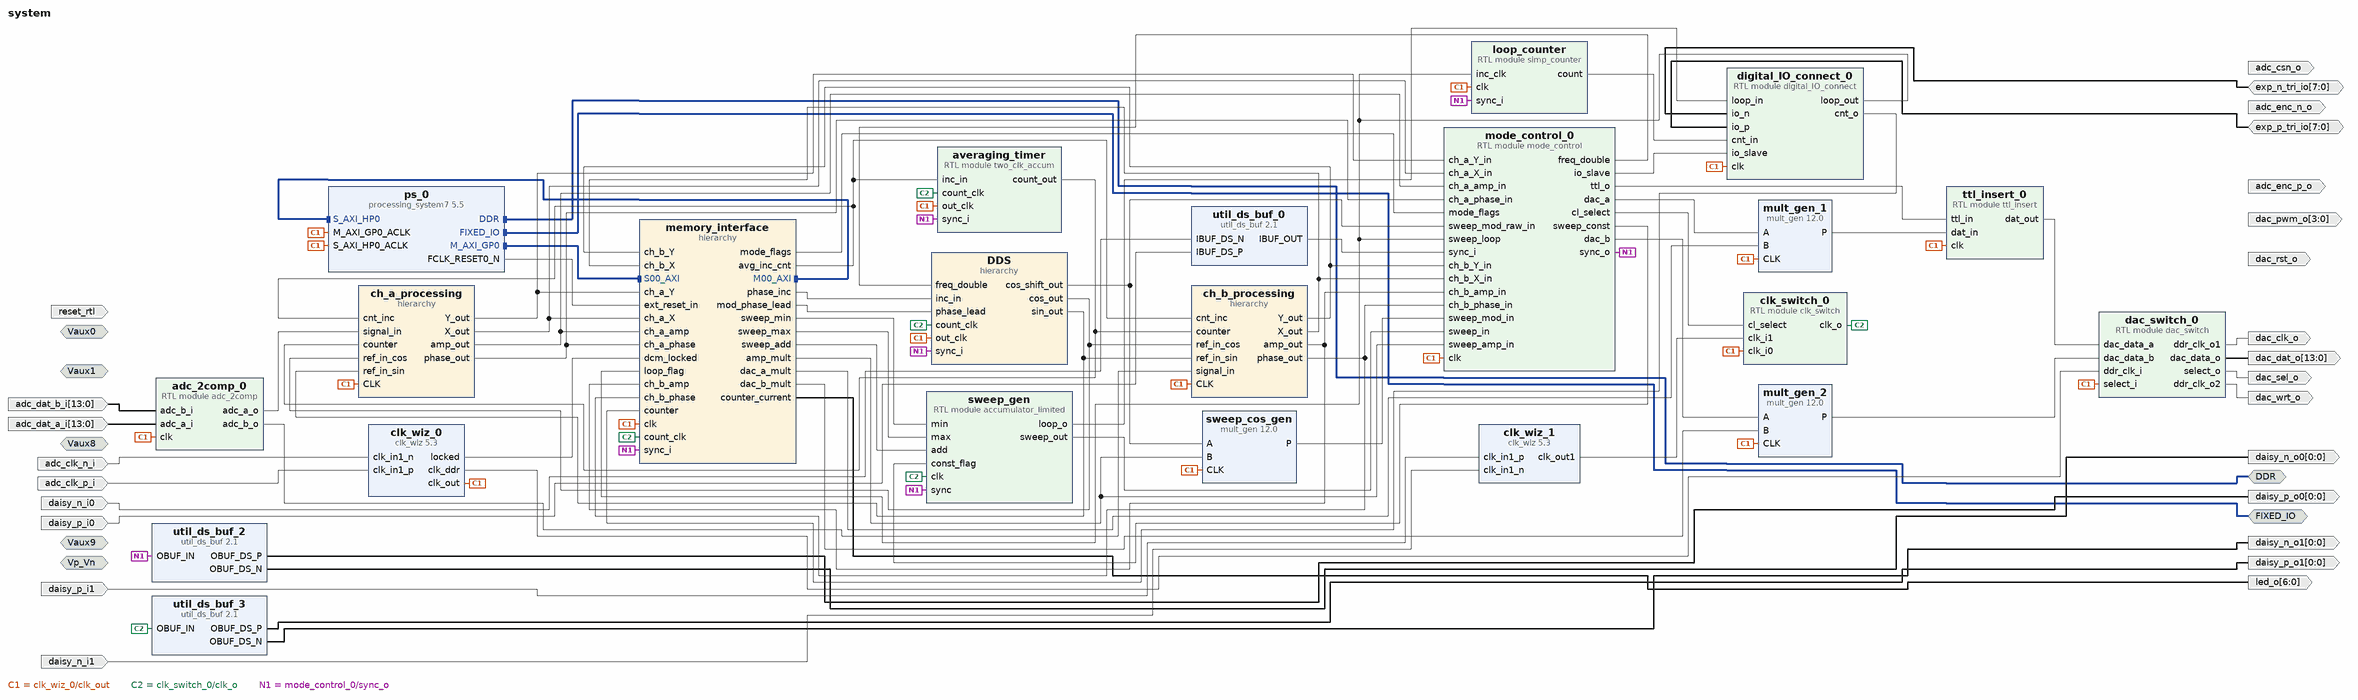
[diagram p0: block diagram of the top level]
# Vivado block design system, xc7z010clg400-1, Vivado 2016.3
create_bd_design system

create_bd_intf_port -mode Master -vlnv xilinx.com:interface:ddrx_rtl:1.0 DDR
create_bd_intf_port -mode Master -vlnv xilinx.com:display_processing_system7:fixedio_rtl:1.0 FIXED_IO
create_bd_intf_port -mode Slave -vlnv xilinx.com:interface:diff_analog_io_rtl:1.0 Vp_Vn
create_bd_intf_port -mode Slave -vlnv xilinx.com:interface:diff_analog_io_rtl:1.0 Vaux0
create_bd_intf_port -mode Slave -vlnv xilinx.com:interface:diff_analog_io_rtl:1.0 Vaux1
create_bd_intf_port -mode Slave -vlnv xilinx.com:interface:diff_analog_io_rtl:1.0 Vaux9
create_bd_intf_port -mode Slave -vlnv xilinx.com:interface:diff_analog_io_rtl:1.0 Vaux8
create_bd_port -dir O adc_enc_p_o
create_bd_port -dir O adc_enc_n_o
create_bd_port -dir O adc_csn_o
create_bd_port -dir O -from 3 -to 0 dac_pwm_o
create_bd_port -dir I -type rst reset_rtl
set_property -dict {CONFIG.POLARITY ACTIVE_HIGH} [get_bd_ports reset_rtl]
create_bd_port -dir O dac_rst_o
create_bd_port -dir O -from 13 -to 0 dac_dat_o
create_bd_port -dir O dac_sel_o
create_bd_port -dir O dac_clk_o
create_bd_port -dir O dac_wrt_o
create_bd_port -dir I -from 13 -to 0 adc_dat_b_i
create_bd_port -dir I -from 13 -to 0 adc_dat_a_i
create_bd_port -dir IO -from 7 -to 0 exp_n_tri_io
create_bd_port -dir IO -from 7 -to 0 exp_p_tri_io
create_bd_port -dir I daisy_n_i0
create_bd_port -dir I daisy_p_i0
create_bd_port -dir O -from 0 -to 0 daisy_p_o0
create_bd_port -dir O -from 0 -to 0 daisy_n_o0
create_bd_port -dir O -from 0 -to 0 daisy_p_o1
create_bd_port -dir O -from 0 -to 0 daisy_n_o1
create_bd_port -dir I adc_clk_n_i
create_bd_port -dir I adc_clk_p_i
create_bd_port -dir I daisy_p_i1
create_bd_port -dir I daisy_n_i1
create_bd_port -dir O -from 6 -to 0 led_o

create_bd_cell -type ip -vlnv xilinx.com:ip:processing_system7:5.5 ps_0
set_property -dict [list \
  CONFIG.PCW_FPGA0_PERIPHERAL_FREQMHZ 125 \
  CONFIG.PCW_FPGA1_PERIPHERAL_FREQMHZ 250 \
  CONFIG.PCW_USE_S_AXI_HP0 1 \
  CONFIG.PCW_S_AXI_HP0_DATA_WIDTH 32 \
  CONFIG.PCW_EN_CLK0_PORT 0 \
  CONFIG.PCW_IMPORT_BOARD_PRESET cfg/red_pitaya.xml \
] [get_bd_cells ps_0]
# 4 more settings of ps_0 are not shown: defaults, MIO pin electricals, DDR timing, and values the tool derives
create_bd_cell -type hier DDS
create_bd_cell -type hier ch_a_processing
create_bd_cell -type ip -vlnv xilinx.com:ip:util_ds_buf:2.1 util_ds_buf_0
create_bd_cell -type ip -vlnv xilinx.com:ip:util_ds_buf:2.1 util_ds_buf_2
set_property -dict {CONFIG.C_BUF_TYPE OBUFDS} [get_bd_cells util_ds_buf_2]
create_bd_cell -type ip -vlnv xilinx.com:ip:util_ds_buf:2.1 util_ds_buf_3
set_property -dict {CONFIG.C_BUF_TYPE OBUFDS} [get_bd_cells util_ds_buf_3]
create_bd_cell -type ip -vlnv xilinx.com:ip:clk_wiz:5.3 clk_wiz_0
set_property -dict [list \
  CONFIG.ENABLE_CLOCK_MONITOR false \
  CONFIG.PRIMITIVE MMCM \
  CONFIG.PRIM_IN_FREQ 125.000 \
  CONFIG.USE_INCLK_SWITCHOVER false \
  CONFIG.SECONDARY_IN_FREQ 125 \
  CONFIG.SECONDARY_SOURCE Differential_clock_capable_pin \
  CONFIG.CLKIN1_JITTER_PS 80.0 \
  CONFIG.CLKIN2_JITTER_PS 80.0 \
  CONFIG.CLKOUT2_USED true \
  CONFIG.CLKOUT3_USED false \
  CONFIG.NUM_OUT_CLKS 2 \
  CONFIG.CLK_OUT1_PORT clk_out \
  CONFIG.CLK_OUT2_PORT clk_ddr \
  CONFIG.CLKOUT1_REQUESTED_OUT_FREQ 125 \
  CONFIG.CLKOUT2_REQUESTED_OUT_FREQ 250 \
  CONFIG.CLKOUT3_REQUESTED_OUT_FREQ 100.000 \
  CONFIG.CLKOUT3_REQUESTED_PHASE 0.000 \
  CONFIG.PRIM_SOURCE Differential_clock_capable_pin \
  CONFIG.CLKOUT1_DRIVES BUFG \
  CONFIG.CLKOUT2_DRIVES BUFG \
  CONFIG.CLKOUT3_DRIVES BUFG \
  CONFIG.CLKOUT4_DRIVES BUFG \
  CONFIG.CLKOUT5_DRIVES BUFG \
  CONFIG.CLKOUT6_DRIVES BUFG \
  CONFIG.CLKOUT7_DRIVES BUFG \
  CONFIG.FEEDBACK_SOURCE FDBK_AUTO \
  CONFIG.CLKFB_IN_SIGNALING SINGLE \
  CONFIG.USE_CLKFB_STOPPED false \
  CONFIG.OVERRIDE_MMCM false \
  CONFIG.MMCM_DIVCLK_DIVIDE 1 \
  CONFIG.MMCM_CLKFBOUT_MULT_F 8.000 \
  CONFIG.MMCM_CLKIN1_PERIOD 8.0 \
  CONFIG.MMCM_CLKIN2_PERIOD 8.000 \
  CONFIG.MMCM_COMPENSATION ZHOLD \
  CONFIG.MMCM_CLKOUT0_DIVIDE_F 8.000 \
  CONFIG.MMCM_CLKOUT1_DIVIDE 4 \
  CONFIG.MMCM_CLKOUT2_DIVIDE 1 \
  CONFIG.MMCM_CLKOUT2_PHASE 0.000 \
  CONFIG.CLKOUT1_JITTER 119.348 \
  CONFIG.CLKOUT1_PHASE_ERROR 96.948 \
  CONFIG.CLKOUT2_JITTER 104.759 \
  CONFIG.CLKOUT2_PHASE_ERROR 96.948 \
  CONFIG.CLKOUT3_JITTER 119.348 \
  CONFIG.CLKOUT3_PHASE_ERROR 96.948 \
] [get_bd_cells clk_wiz_0]
create_bd_cell -type ip -vlnv xilinx.com:ip:clk_wiz:5.3 clk_wiz_1
set_property -dict [list \
  CONFIG.PRIMITIVE PLL \
  CONFIG.PRIM_IN_FREQ 125 \
  CONFIG.CLKIN1_JITTER_PS 80.0 \
  CONFIG.CLKOUT1_REQUESTED_OUT_FREQ 125 \
  CONFIG.PRIM_SOURCE Differential_clock_capable_pin \
  CONFIG.CLKOUT1_DRIVES BUFG \
  CONFIG.CLKOUT2_DRIVES BUFG \
  CONFIG.CLKOUT3_DRIVES BUFG \
  CONFIG.CLKOUT4_DRIVES BUFG \
  CONFIG.CLKOUT5_DRIVES BUFG \
  CONFIG.CLKOUT6_DRIVES BUFG \
  CONFIG.CLKOUT7_DRIVES BUFG \
  CONFIG.MMCM_DIVCLK_DIVIDE 1 \
  CONFIG.MMCM_CLKFBOUT_MULT_F 7 \
  CONFIG.MMCM_CLKIN1_PERIOD 8.0 \
  CONFIG.MMCM_COMPENSATION ZHOLD \
  CONFIG.MMCM_CLKOUT0_DIVIDE_F 7 \
  CONFIG.CLKOUT1_JITTER 125.031 \
  CONFIG.CLKOUT1_PHASE_ERROR 104.065 \
] [get_bd_cells clk_wiz_1]
create_bd_cell -type hier ch_b_processing
create_bd_cell -type ip -vlnv xilinx.com:ip:mult_gen:12.0 sweep_cos_gen
set_property -dict [list \
  CONFIG.PortAType Signed \
  CONFIG.PortAWidth 16 \
  CONFIG.PortBType Unsigned \
  CONFIG.PortBWidth 32 \
  CONFIG.Multiplier_Construction Use_Mults \
  CONFIG.Use_Custom_Output_Width true \
  CONFIG.OutputWidthHigh 47 \
  CONFIG.OutputWidthLow 24 \
  CONFIG.PipeStages 4 \
] [get_bd_cells sweep_cos_gen]
create_bd_cell -type ip -vlnv xilinx.com:ip:mult_gen:12.0 mult_gen_1
set_property -dict [list \
  CONFIG.PortAType Signed \
  CONFIG.PortAWidth 24 \
  CONFIG.PortBType Unsigned \
  CONFIG.PortBWidth 16 \
  CONFIG.Multiplier_Construction Use_Mults \
  CONFIG.Use_Custom_Output_Width true \
  CONFIG.OutputWidthHigh 23 \
  CONFIG.OutputWidthLow 10 \
  CONFIG.PipeStages 3 \
] [get_bd_cells mult_gen_1]
create_bd_cell -type ip -vlnv xilinx.com:ip:mult_gen:12.0 mult_gen_2
set_property -dict [list \
  CONFIG.PortAType Signed \
  CONFIG.PortAWidth 24 \
  CONFIG.PortBType Unsigned \
  CONFIG.PortBWidth 16 \
  CONFIG.Multiplier_Construction Use_Mults \
  CONFIG.Use_Custom_Output_Width true \
  CONFIG.OutputWidthHigh 23 \
  CONFIG.OutputWidthLow 10 \
  CONFIG.PipeStages 3 \
] [get_bd_cells mult_gen_2]
create_bd_cell -type hier memory_interface
create_bd_cell -type module -reference accumulator_limited sweep_gen
set_property -dict {CONFIG.accum_bits 40 CONFIG.out_bits 24} [get_bd_cells sweep_gen]
create_bd_cell -type module -reference mode_control mode_control_0
set_property -dict [list \
  CONFIG.in_bits_sweep 24 \
  CONFIG.in_bits_sweep_mod 24 \
  CONFIG.phase_correct_bits 2 \
  CONFIG.out_bits_dac 24 \
] [get_bd_cells mode_control_0]
create_bd_cell -type module -reference ttl_insert ttl_insert_0
create_bd_cell -type module -reference simp_counter loop_counter
set_property -dict {CONFIG.CNT_BITS 7} [get_bd_cells loop_counter]
create_bd_cell -type module -reference adc_2comp adc_2comp_0
create_bd_cell -type module -reference clk_switch clk_switch_0
create_bd_cell -type module -reference dac_switch dac_switch_0
create_bd_cell -type module -reference digital_IO_connect digital_IO_connect_0
set_property -dict {CONFIG.cnt_bits 7} [get_bd_cells digital_IO_connect_0]
create_bd_cell -type module -reference two_clk_accum averaging_timer

# ---- hierarchy /DDS ----
current_bd_instance /DDS
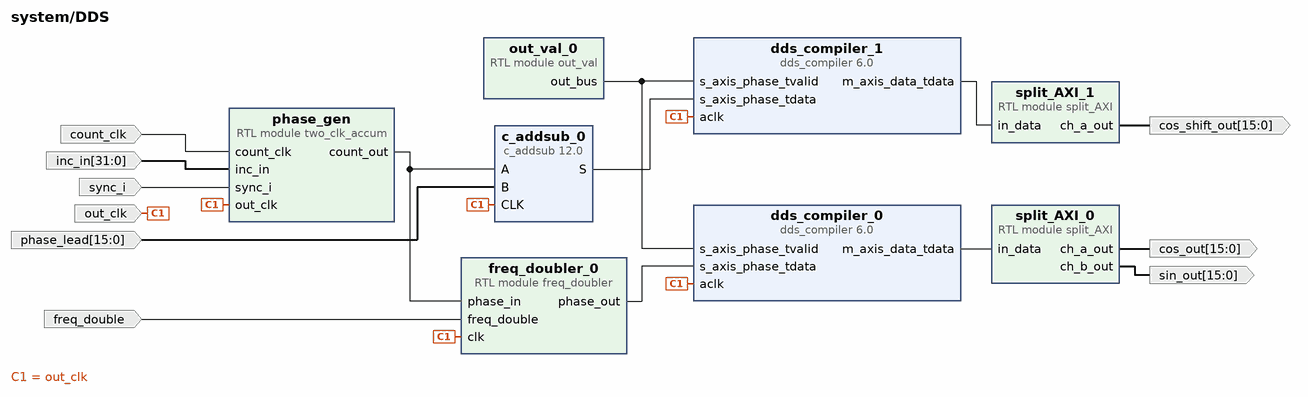
[diagram p1: block diagram inside /DDS]
create_bd_pin -dir I count_clk
create_bd_pin -dir I out_clk
create_bd_pin -dir I -from 31 -to 0 inc_in
create_bd_pin -dir I sync_i
create_bd_pin -dir O -from 15 -to 0 cos_out
create_bd_pin -dir O -from 15 -to 0 sin_out
create_bd_pin -dir O -from 15 -to 0 cos_shift_out
create_bd_pin -dir I freq_double
create_bd_pin -dir I -from 15 -to 0 phase_lead

create_bd_cell -type ip -vlnv xilinx.com:ip:dds_compiler:6.0 dds_compiler_0
set_property -dict [list \
  CONFIG.PartsPresent SIN_COS_LUT_only \
  CONFIG.DDS_Clock_Rate 100 \
  CONFIG.Parameter_Entry Hardware_Parameters \
  CONFIG.Frequency_Resolution 0.4 \
  CONFIG.Noise_Shaping None \
  CONFIG.Phase_Width 16 \
  CONFIG.Output_Width 16 \
  CONFIG.Phase_Increment Streaming \
  CONFIG.Has_Phase_Out false \
  CONFIG.DATA_Has_TLAST Not_Required \
  CONFIG.S_PHASE_Has_TUSER Not_Required \
  CONFIG.M_DATA_Has_TUSER Not_Required \
  CONFIG.Latency 6 \
  CONFIG.Output_Frequency1 0 \
  CONFIG.PINC1 0 \
] [get_bd_cells dds_compiler_0]
create_bd_cell -type ip -vlnv xilinx.com:ip:dds_compiler:6.0 dds_compiler_1
set_property -dict [list \
  CONFIG.PartsPresent SIN_COS_LUT_only \
  CONFIG.DDS_Clock_Rate 100 \
  CONFIG.Parameter_Entry Hardware_Parameters \
  CONFIG.Frequency_Resolution 0.4 \
  CONFIG.Noise_Shaping None \
  CONFIG.Phase_Width 16 \
  CONFIG.Output_Width 16 \
  CONFIG.Phase_Increment Fixed \
  CONFIG.Has_Phase_Out false \
  CONFIG.DATA_Has_TLAST Not_Required \
  CONFIG.S_PHASE_Has_TUSER Not_Required \
  CONFIG.M_DATA_Has_TUSER Not_Required \
  CONFIG.Latency 6 \
  CONFIG.Output_Frequency1 0 \
  CONFIG.PINC1 0 \
] [get_bd_cells dds_compiler_1]
create_bd_cell -type ip -vlnv xilinx.com:ip:c_addsub:12.0 c_addsub_0
set_property -dict [list \
  CONFIG.A_Type Signed \
  CONFIG.B_Type Signed \
  CONFIG.A_Width 16 \
  CONFIG.B_Width 16 \
  CONFIG.Out_Width 16 \
  CONFIG.Latency_Configuration Manual \
  CONFIG.Latency 1 \
  CONFIG.B_Value 0000000000000000 \
  CONFIG.CE false \
] [get_bd_cells c_addsub_0]
create_bd_cell -type module -reference freq_doubler freq_doubler_0
create_bd_cell -type module -reference out_val out_val_0
create_bd_cell -type module -reference split_AXI split_AXI_0
set_property -dict {CONFIG.OUT_DATA_WIDTH 16} [get_bd_cells split_AXI_0]
create_bd_cell -type module -reference split_AXI split_AXI_1
set_property -dict {CONFIG.OUT_DATA_WIDTH 16} [get_bd_cells split_AXI_1]
create_bd_cell -type module -reference two_clk_accum phase_gen
set_property -dict {CONFIG.out_bits 16 CONFIG.out_bus_size 16} [get_bd_cells phase_gen]

# ---- hierarchy /ch_a_processing ----
current_bd_instance /ch_a_processing
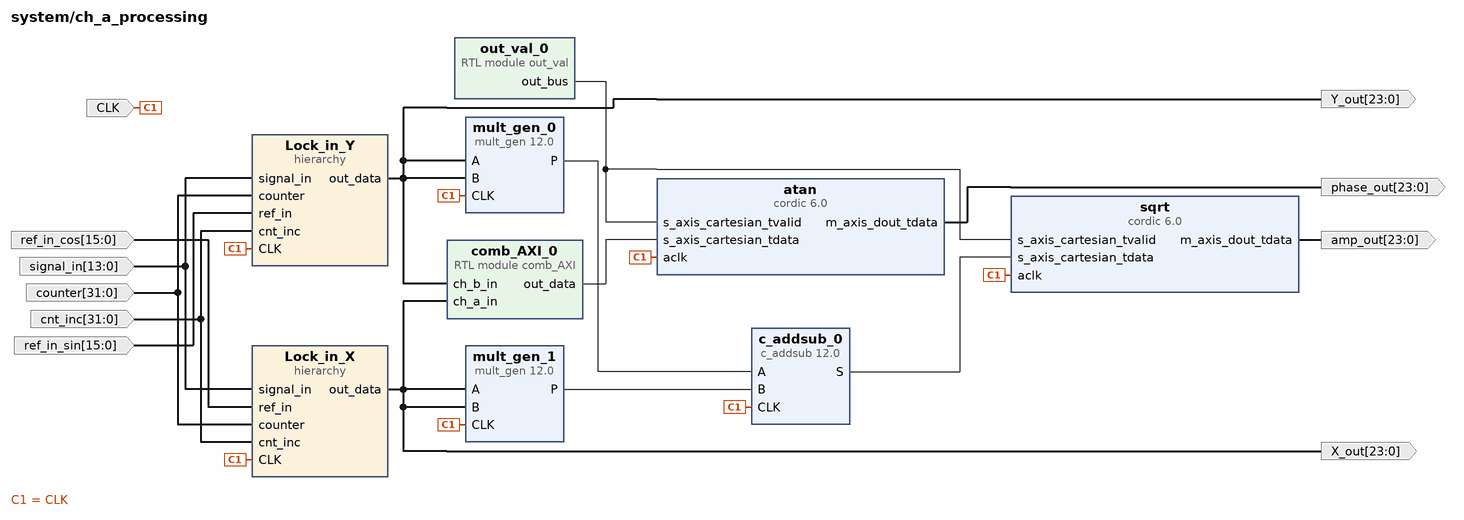
[diagram p2: block diagram inside /ch_a_processing]
create_bd_pin -dir I -type clk CLK
create_bd_pin -dir O -from 23 -to 0 Y_out
create_bd_pin -dir O -from 23 -to 0 X_out
create_bd_pin -dir O -from 23 -to 0 amp_out
create_bd_pin -dir O -from 23 -to 0 phase_out
create_bd_pin -dir I -from 13 -to 0 -type data signal_in
create_bd_pin -dir I -from 31 -to 0 counter
create_bd_pin -dir I -from 31 -to 0 cnt_inc
create_bd_pin -dir I -from 15 -to 0 ref_in_sin
create_bd_pin -dir I -from 15 -to 0 ref_in_cos

create_bd_cell -type ip -vlnv xilinx.com:ip:mult_gen:12.0 mult_gen_0
set_property -dict [list \
  CONFIG.PortAType Signed \
  CONFIG.PortAWidth 24 \
  CONFIG.PortBType Signed \
  CONFIG.PortBWidth 24 \
  CONFIG.Multiplier_Construction Use_Mults \
  CONFIG.Use_Custom_Output_Width true \
  CONFIG.OutputWidthHigh 47 \
  CONFIG.PipeStages 4 \
] [get_bd_cells mult_gen_0]
create_bd_cell -type ip -vlnv xilinx.com:ip:mult_gen:12.0 mult_gen_1
set_property -dict [list \
  CONFIG.PortAType Signed \
  CONFIG.PortAWidth 24 \
  CONFIG.PortBType Signed \
  CONFIG.PortBWidth 24 \
  CONFIG.Multiplier_Construction Use_Mults \
  CONFIG.Use_Custom_Output_Width true \
  CONFIG.OutputWidthHigh 47 \
  CONFIG.PipeStages 4 \
] [get_bd_cells mult_gen_1]
create_bd_cell -type ip -vlnv xilinx.com:ip:c_addsub:12.0 c_addsub_0
set_property -dict [list \
  CONFIG.A_Type Signed \
  CONFIG.B_Type Signed \
  CONFIG.A_Width 48 \
  CONFIG.B_Width 48 \
  CONFIG.Out_Width 48 \
  CONFIG.Latency_Configuration Automatic \
  CONFIG.Latency 4 \
  CONFIG.B_Value 000000000000000000000000000000000000000000000000 \
  CONFIG.CE false \
] [get_bd_cells c_addsub_0]
create_bd_cell -type ip -vlnv xilinx.com:ip:cordic:6.0 sqrt
set_property -dict [list \
  CONFIG.Functional_Selection Square_Root \
  CONFIG.Pipelining_Mode Optimal \
  CONFIG.Data_Format UnsignedInteger \
  CONFIG.Input_Width 47 \
  CONFIG.Output_Width 24 \
  CONFIG.Coarse_Rotation false \
] [get_bd_cells sqrt]
create_bd_cell -type ip -vlnv xilinx.com:ip:cordic:6.0 atan
set_property -dict [list \
  CONFIG.Functional_Selection Arc_Tan \
  CONFIG.Architectural_Configuration Word_Serial \
  CONFIG.Pipelining_Mode Optimal \
  CONFIG.Data_Format SignedFraction \
  CONFIG.Phase_Format Scaled_Radians \
  CONFIG.Input_Width 24 \
  CONFIG.Output_Width 24 \
  CONFIG.Iterations 0 \
  CONFIG.Precision 0 \
  CONFIG.Coarse_Rotation true \
] [get_bd_cells atan]
create_bd_cell -type hier Lock_in_Y
create_bd_cell -type hier Lock_in_X
create_bd_cell -type module -reference comb_AXI comb_AXI_0
set_property -dict {CONFIG.fract 1} [get_bd_cells comb_AXI_0]
create_bd_cell -type module -reference out_val out_val_0

# ---- hierarchy /ch_a_processing/Lock_in_Y ----
current_bd_instance /ch_a_processing/Lock_in_Y
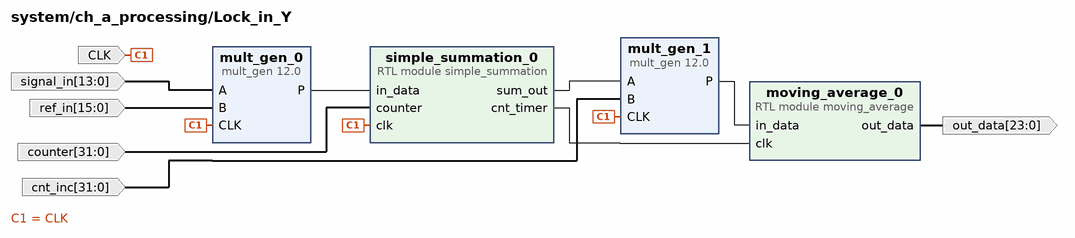
[diagram p3: block diagram inside /ch_a_processing/Lock_in_Y]
create_bd_pin -dir I -type clk CLK
create_bd_pin -dir I -from 13 -to 0 -type data signal_in
create_bd_pin -dir I -from 31 -to 0 counter
create_bd_pin -dir I -from 31 -to 0 cnt_inc
create_bd_pin -dir O -from 23 -to 0 out_data
create_bd_pin -dir I -from 15 -to 0 ref_in

create_bd_cell -type ip -vlnv xilinx.com:ip:mult_gen:12.0 mult_gen_1
set_property -dict [list \
  CONFIG.PortAType Signed \
  CONFIG.PortAWidth 56 \
  CONFIG.PortBType Unsigned \
  CONFIG.PortBWidth 32 \
  CONFIG.Multiplier_Construction Use_Mults \
  CONFIG.Use_Custom_Output_Width true \
  CONFIG.OutputWidthHigh 55 \
  CONFIG.OutputWidthLow 32 \
  CONFIG.PipeStages 8 \
] [get_bd_cells mult_gen_1]
create_bd_cell -type ip -vlnv xilinx.com:ip:mult_gen:12.0 mult_gen_0
set_property -dict [list \
  CONFIG.MultType Parallel_Multiplier \
  CONFIG.PortAType Signed \
  CONFIG.PortAWidth 14 \
  CONFIG.PortBType Signed \
  CONFIG.PortBWidth 16 \
  CONFIG.Multiplier_Construction Use_Mults \
  CONFIG.OptGoal Speed \
  CONFIG.Use_Custom_Output_Width true \
  CONFIG.OutputWidthHigh 28 \
  CONFIG.OutputWidthLow 5 \
  CONFIG.PipeStages 3 \
] [get_bd_cells mult_gen_0]
create_bd_cell -type module -reference moving_average moving_average_0
set_property -dict {CONFIG.in_bits 24 CONFIG.out_bits 24 CONFIG.log2_samples 6} [get_bd_cells moving_average_0]
create_bd_cell -type module -reference simple_summation simple_summation_0
set_property -dict {CONFIG.dat_in_bits 24 CONFIG.cnt_in_bits 32} [get_bd_cells simple_summation_0]

# ---- hierarchy /ch_a_processing/Lock_in_X ----
current_bd_instance /ch_a_processing/Lock_in_X
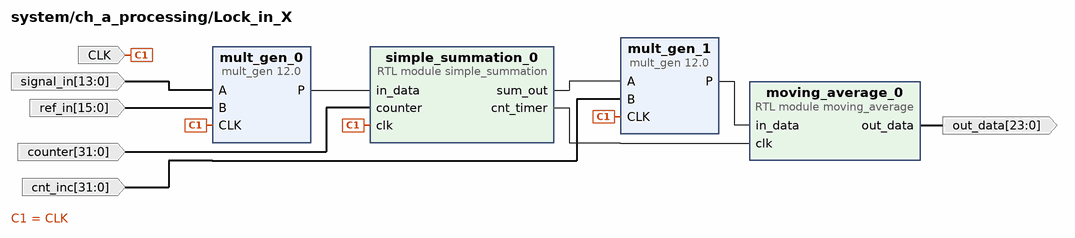
[diagram p4: block diagram inside /ch_a_processing/Lock_in_X]
create_bd_pin -dir I -type clk CLK
create_bd_pin -dir I -from 13 -to 0 -type data signal_in
create_bd_pin -dir I -from 31 -to 0 counter
create_bd_pin -dir I -from 31 -to 0 cnt_inc
create_bd_pin -dir O -from 23 -to 0 out_data
create_bd_pin -dir I -from 15 -to 0 ref_in

create_bd_cell -type ip -vlnv xilinx.com:ip:mult_gen:12.0 mult_gen_1
set_property -dict [list \
  CONFIG.PortAType Signed \
  CONFIG.PortAWidth 56 \
  CONFIG.PortBType Unsigned \
  CONFIG.PortBWidth 32 \
  CONFIG.Multiplier_Construction Use_Mults \
  CONFIG.Use_Custom_Output_Width true \
  CONFIG.OutputWidthHigh 55 \
  CONFIG.OutputWidthLow 32 \
  CONFIG.PipeStages 8 \
] [get_bd_cells mult_gen_1]
create_bd_cell -type ip -vlnv xilinx.com:ip:mult_gen:12.0 mult_gen_0
set_property -dict [list \
  CONFIG.MultType Parallel_Multiplier \
  CONFIG.PortAType Signed \
  CONFIG.PortAWidth 14 \
  CONFIG.PortBType Signed \
  CONFIG.PortBWidth 16 \
  CONFIG.Multiplier_Construction Use_Mults \
  CONFIG.OptGoal Speed \
  CONFIG.Use_Custom_Output_Width true \
  CONFIG.OutputWidthHigh 28 \
  CONFIG.OutputWidthLow 5 \
  CONFIG.PipeStages 3 \
] [get_bd_cells mult_gen_0]
create_bd_cell -type module -reference moving_average moving_average_0
set_property -dict {CONFIG.in_bits 24 CONFIG.out_bits 24 CONFIG.log2_samples 6} [get_bd_cells moving_average_0]
create_bd_cell -type module -reference simple_summation simple_summation_0
set_property -dict {CONFIG.dat_in_bits 24 CONFIG.cnt_in_bits 32} [get_bd_cells simple_summation_0]

# ---- hierarchy /ch_b_processing ----
current_bd_instance /ch_b_processing
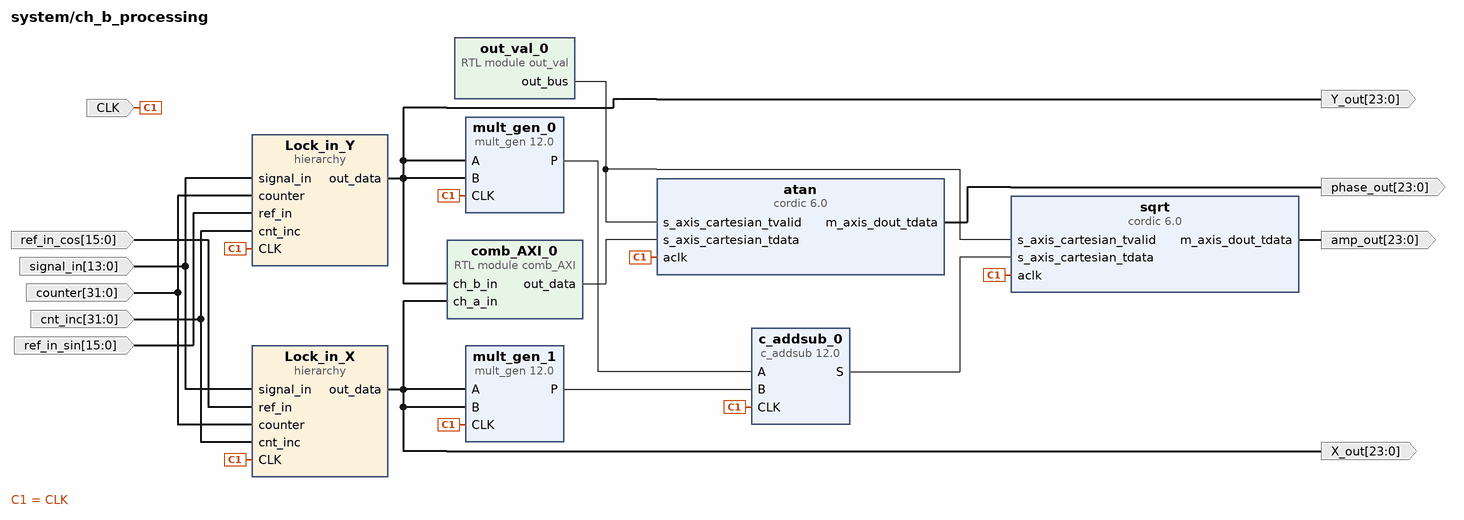
[diagram p5: block diagram inside /ch_b_processing]
create_bd_pin -dir I -type clk CLK
create_bd_pin -dir O -from 23 -to 0 Y_out
create_bd_pin -dir O -from 23 -to 0 X_out
create_bd_pin -dir O -from 23 -to 0 amp_out
create_bd_pin -dir O -from 23 -to 0 phase_out
create_bd_pin -dir I -from 13 -to 0 -type data signal_in
create_bd_pin -dir I -from 31 -to 0 counter
create_bd_pin -dir I -from 31 -to 0 cnt_inc
create_bd_pin -dir I -from 15 -to 0 ref_in_sin
create_bd_pin -dir I -from 15 -to 0 ref_in_cos

create_bd_cell -type ip -vlnv xilinx.com:ip:mult_gen:12.0 mult_gen_0
set_property -dict [list \
  CONFIG.PortAType Signed \
  CONFIG.PortAWidth 24 \
  CONFIG.PortBType Signed \
  CONFIG.PortBWidth 24 \
  CONFIG.Multiplier_Construction Use_Mults \
  CONFIG.Use_Custom_Output_Width true \
  CONFIG.OutputWidthHigh 47 \
  CONFIG.PipeStages 4 \
] [get_bd_cells mult_gen_0]
create_bd_cell -type ip -vlnv xilinx.com:ip:mult_gen:12.0 mult_gen_1
set_property -dict [list \
  CONFIG.PortAType Signed \
  CONFIG.PortAWidth 24 \
  CONFIG.PortBType Signed \
  CONFIG.PortBWidth 24 \
  CONFIG.Multiplier_Construction Use_Mults \
  CONFIG.Use_Custom_Output_Width true \
  CONFIG.OutputWidthHigh 47 \
  CONFIG.PipeStages 4 \
] [get_bd_cells mult_gen_1]
create_bd_cell -type ip -vlnv xilinx.com:ip:c_addsub:12.0 c_addsub_0
set_property -dict [list \
  CONFIG.A_Type Signed \
  CONFIG.B_Type Signed \
  CONFIG.A_Width 48 \
  CONFIG.B_Width 48 \
  CONFIG.Out_Width 48 \
  CONFIG.Latency_Configuration Automatic \
  CONFIG.Latency 4 \
  CONFIG.B_Value 000000000000000000000000000000000000000000000000 \
  CONFIG.CE false \
] [get_bd_cells c_addsub_0]
create_bd_cell -type ip -vlnv xilinx.com:ip:cordic:6.0 sqrt
set_property -dict [list \
  CONFIG.Functional_Selection Square_Root \
  CONFIG.Pipelining_Mode Optimal \
  CONFIG.Data_Format UnsignedInteger \
  CONFIG.Input_Width 47 \
  CONFIG.Output_Width 24 \
  CONFIG.Coarse_Rotation false \
] [get_bd_cells sqrt]
create_bd_cell -type ip -vlnv xilinx.com:ip:cordic:6.0 atan
set_property -dict [list \
  CONFIG.Functional_Selection Arc_Tan \
  CONFIG.Architectural_Configuration Word_Serial \
  CONFIG.Pipelining_Mode Optimal \
  CONFIG.Data_Format SignedFraction \
  CONFIG.Phase_Format Scaled_Radians \
  CONFIG.Input_Width 24 \
  CONFIG.Output_Width 24 \
  CONFIG.Iterations 0 \
  CONFIG.Precision 0 \
  CONFIG.Coarse_Rotation true \
] [get_bd_cells atan]
create_bd_cell -type hier Lock_in_Y
create_bd_cell -type hier Lock_in_X
create_bd_cell -type module -reference out_val out_val_0
create_bd_cell -type module -reference comb_AXI comb_AXI_0
set_property -dict {CONFIG.fract 1} [get_bd_cells comb_AXI_0]

# ---- hierarchy /ch_b_processing/Lock_in_Y ----
current_bd_instance /ch_b_processing/Lock_in_Y
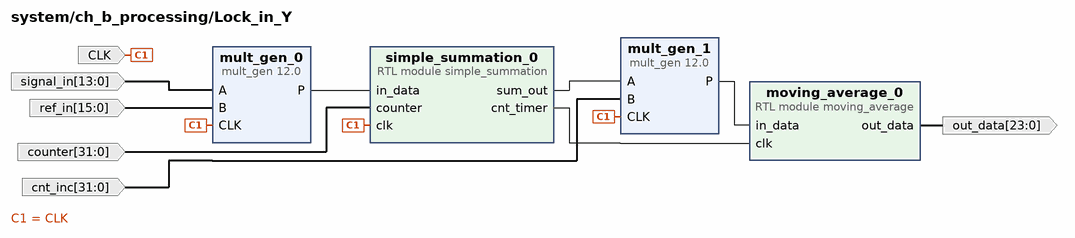
[diagram p6: block diagram inside /ch_b_processing/Lock_in_Y]
create_bd_pin -dir I -type clk CLK
create_bd_pin -dir I -from 13 -to 0 -type data signal_in
create_bd_pin -dir I -from 31 -to 0 counter
create_bd_pin -dir I -from 31 -to 0 cnt_inc
create_bd_pin -dir O -from 23 -to 0 out_data
create_bd_pin -dir I -from 15 -to 0 ref_in

create_bd_cell -type ip -vlnv xilinx.com:ip:mult_gen:12.0 mult_gen_1
set_property -dict [list \
  CONFIG.PortAType Signed \
  CONFIG.PortAWidth 56 \
  CONFIG.PortBType Unsigned \
  CONFIG.PortBWidth 32 \
  CONFIG.Multiplier_Construction Use_Mults \
  CONFIG.Use_Custom_Output_Width true \
  CONFIG.OutputWidthHigh 55 \
  CONFIG.OutputWidthLow 32 \
  CONFIG.PipeStages 8 \
] [get_bd_cells mult_gen_1]
create_bd_cell -type ip -vlnv xilinx.com:ip:mult_gen:12.0 mult_gen_0
set_property -dict [list \
  CONFIG.MultType Parallel_Multiplier \
  CONFIG.PortAType Signed \
  CONFIG.PortAWidth 14 \
  CONFIG.PortBType Signed \
  CONFIG.PortBWidth 16 \
  CONFIG.Multiplier_Construction Use_Mults \
  CONFIG.OptGoal Speed \
  CONFIG.Use_Custom_Output_Width true \
  CONFIG.OutputWidthHigh 28 \
  CONFIG.OutputWidthLow 5 \
  CONFIG.PipeStages 3 \
] [get_bd_cells mult_gen_0]
create_bd_cell -type module -reference moving_average moving_average_0
set_property -dict {CONFIG.in_bits 24 CONFIG.out_bits 24 CONFIG.log2_samples 6} [get_bd_cells moving_average_0]
create_bd_cell -type module -reference simple_summation simple_summation_0
set_property -dict {CONFIG.dat_in_bits 24 CONFIG.cnt_in_bits 32} [get_bd_cells simple_summation_0]

# ---- hierarchy /ch_b_processing/Lock_in_X ----
current_bd_instance /ch_b_processing/Lock_in_X
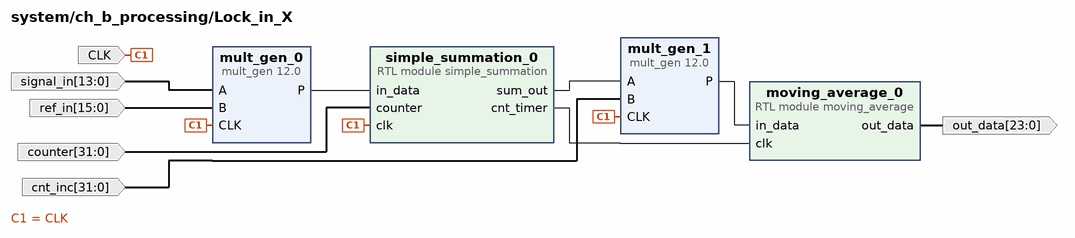
[diagram p7: block diagram inside /ch_b_processing/Lock_in_X]
create_bd_pin -dir I -type clk CLK
create_bd_pin -dir I -from 13 -to 0 -type data signal_in
create_bd_pin -dir I -from 31 -to 0 counter
create_bd_pin -dir I -from 31 -to 0 cnt_inc
create_bd_pin -dir O -from 23 -to 0 out_data
create_bd_pin -dir I -from 15 -to 0 ref_in

create_bd_cell -type ip -vlnv xilinx.com:ip:mult_gen:12.0 mult_gen_1
set_property -dict [list \
  CONFIG.PortAType Signed \
  CONFIG.PortAWidth 56 \
  CONFIG.PortBType Unsigned \
  CONFIG.PortBWidth 32 \
  CONFIG.Multiplier_Construction Use_Mults \
  CONFIG.Use_Custom_Output_Width true \
  CONFIG.OutputWidthHigh 55 \
  CONFIG.OutputWidthLow 32 \
  CONFIG.PipeStages 8 \
] [get_bd_cells mult_gen_1]
create_bd_cell -type ip -vlnv xilinx.com:ip:mult_gen:12.0 mult_gen_0
set_property -dict [list \
  CONFIG.MultType Parallel_Multiplier \
  CONFIG.PortAType Signed \
  CONFIG.PortAWidth 14 \
  CONFIG.PortBType Signed \
  CONFIG.PortBWidth 16 \
  CONFIG.Multiplier_Construction Use_Mults \
  CONFIG.OptGoal Speed \
  CONFIG.Use_Custom_Output_Width true \
  CONFIG.OutputWidthHigh 28 \
  CONFIG.OutputWidthLow 5 \
  CONFIG.PipeStages 3 \
] [get_bd_cells mult_gen_0]
create_bd_cell -type module -reference moving_average moving_average_0
set_property -dict {CONFIG.in_bits 24 CONFIG.out_bits 24 CONFIG.log2_samples 6} [get_bd_cells moving_average_0]
create_bd_cell -type module -reference simple_summation simple_summation_0
set_property -dict {CONFIG.dat_in_bits 24 CONFIG.cnt_in_bits 32} [get_bd_cells simple_summation_0]

# ---- hierarchy /memory_interface ----
current_bd_instance /memory_interface
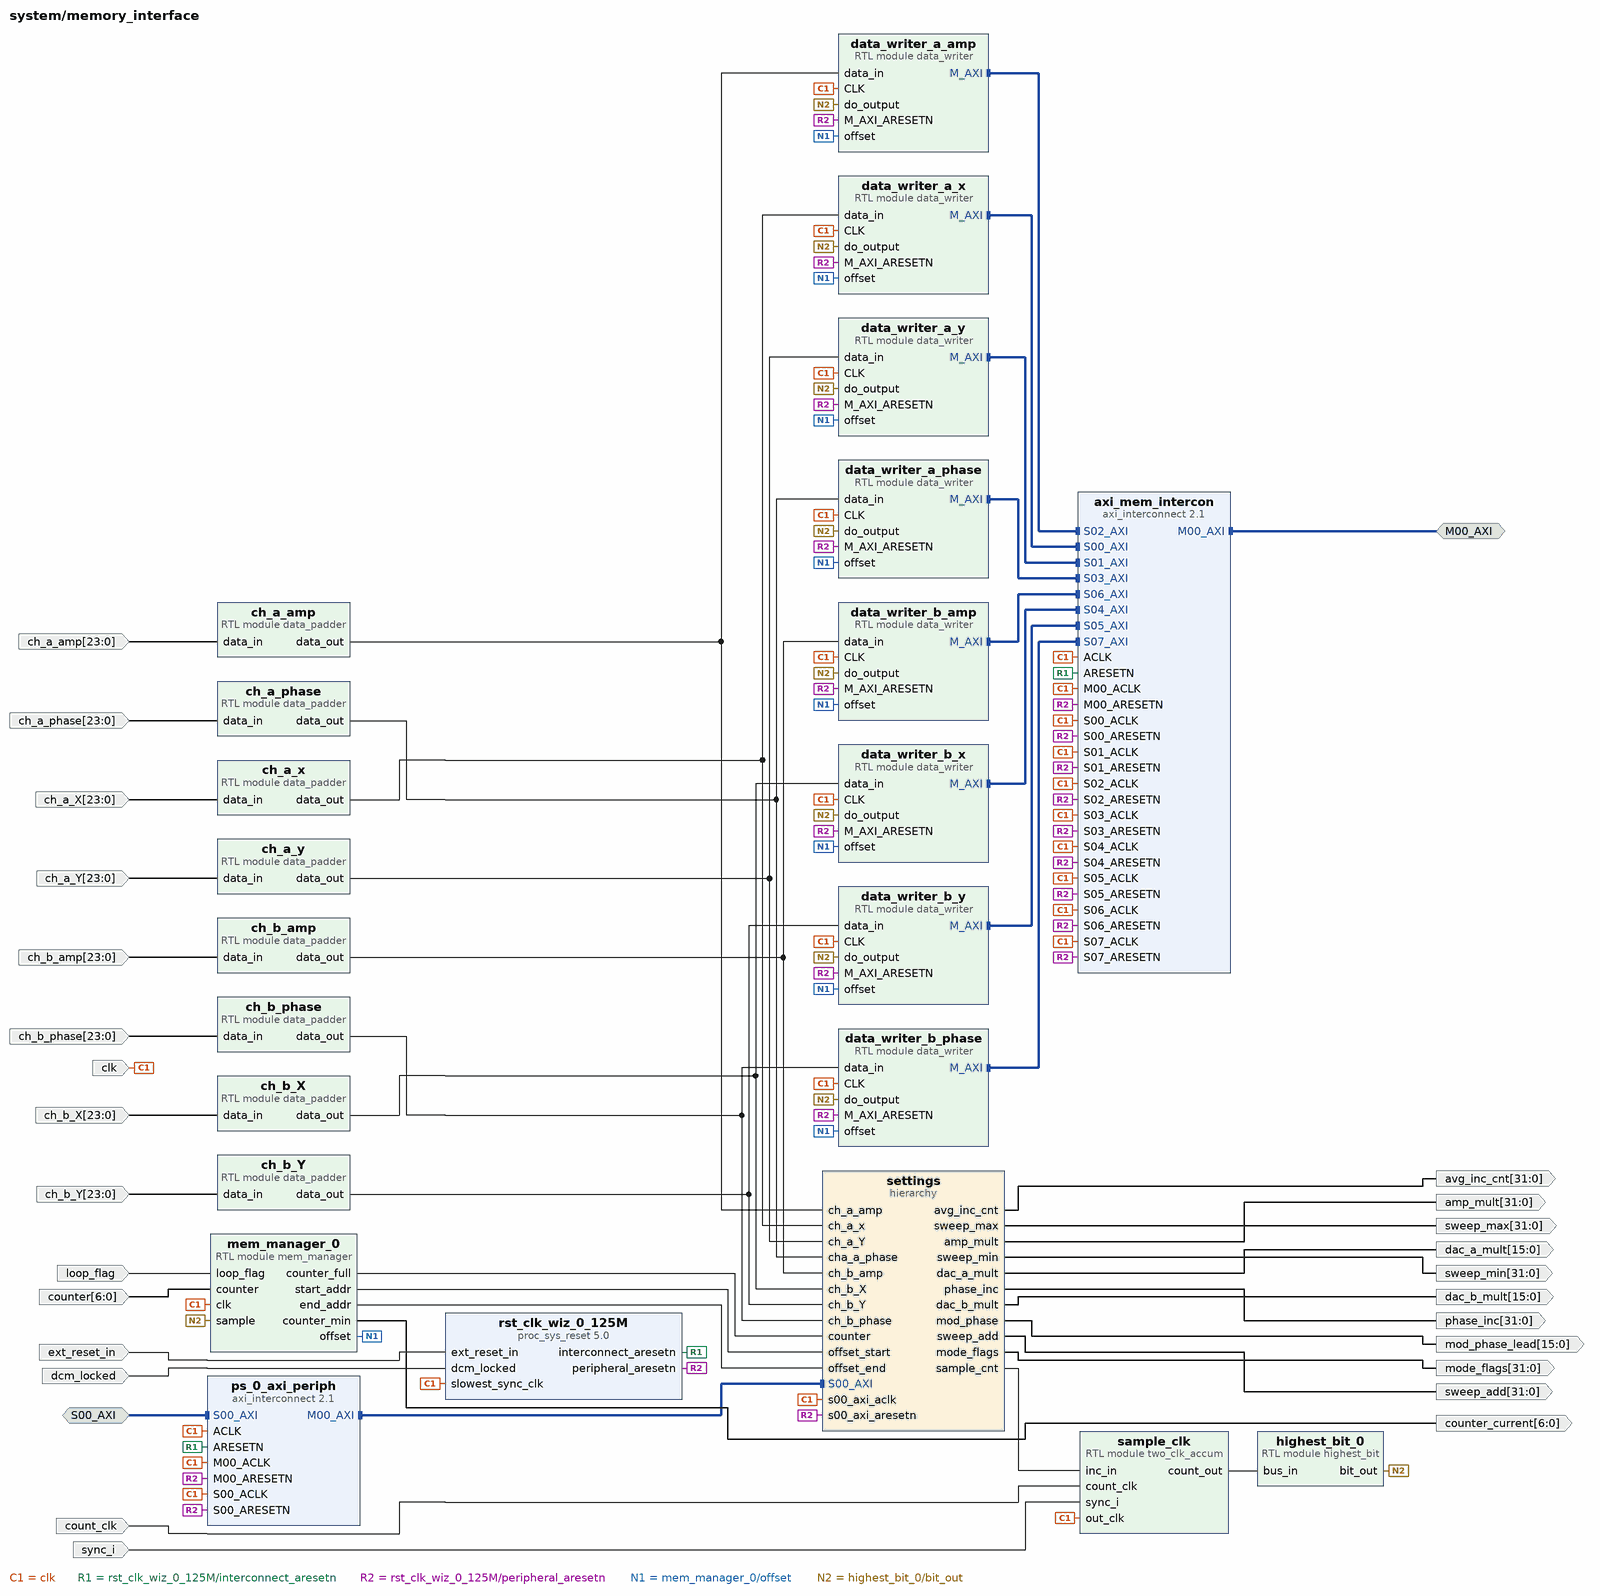
[diagram p8: block diagram inside /memory_interface]
create_bd_intf_pin -mode Slave -vlnv xilinx.com:interface:aximm_rtl:1.0 S00_AXI
create_bd_intf_pin -mode Master -vlnv xilinx.com:interface:aximm_rtl:1.0 M00_AXI
create_bd_pin -dir I -type clk clk
create_bd_pin -dir O -from 31 -to 0 avg_inc_cnt
create_bd_pin -dir O -from 31 -to 0 sweep_max
create_bd_pin -dir O -from 31 -to 0 sweep_min
create_bd_pin -dir O -from 31 -to 0 phase_inc
create_bd_pin -dir O -from 31 -to 0 amp_mult
create_bd_pin -dir O -from 15 -to 0 dac_a_mult
create_bd_pin -dir O -from 31 -to 0 sweep_add
create_bd_pin -dir O -from 15 -to 0 dac_b_mult
create_bd_pin -dir O -from 31 -to 0 mode_flags
create_bd_pin -dir O -from 15 -to 0 mod_phase_lead
create_bd_pin -dir I -from 23 -to 0 ch_a_X
create_bd_pin -dir I -from 23 -to 0 ch_a_Y
create_bd_pin -dir I -from 23 -to 0 ch_a_amp
create_bd_pin -dir I -from 23 -to 0 ch_a_phase
create_bd_pin -dir I -from 23 -to 0 ch_b_X
create_bd_pin -dir I -from 23 -to 0 ch_b_Y
create_bd_pin -dir I -from 23 -to 0 ch_b_amp
create_bd_pin -dir I -from 23 -to 0 ch_b_phase
create_bd_pin -dir I -type rst ext_reset_in
create_bd_pin -dir I dcm_locked
create_bd_pin -dir I loop_flag
create_bd_pin -dir I count_clk
create_bd_pin -dir I sync_i
create_bd_pin -dir I -from 6 -to 0 counter
create_bd_pin -dir O -from 6 -to 0 counter_current

create_bd_cell -type hier settings
create_bd_cell -type ip -vlnv xilinx.com:ip:axi_interconnect:2.1 ps_0_axi_periph
set_property -dict {CONFIG.NUM_MI 1} [get_bd_cells ps_0_axi_periph]
create_bd_cell -type ip -vlnv xilinx.com:ip:proc_sys_reset:5.0 rst_clk_wiz_0_125M
create_bd_cell -type ip -vlnv xilinx.com:ip:axi_interconnect:2.1 axi_mem_intercon
set_property -dict {CONFIG.NUM_SI 8 CONFIG.NUM_MI 1} [get_bd_cells axi_mem_intercon]
create_bd_cell -type module -reference data_writer data_writer_a_x
set_property -dict {CONFIG.C_M_TARGET_SLAVE_BASE_ADDR 0x18000000 CONFIG.C_M_AXI_ID_WIDTH 3} [get_bd_cells data_writer_a_x]
create_bd_cell -type module -reference mem_manager mem_manager_0
set_property -dict {CONFIG.MEM_WIDTH 0x00800000 CONFIG.COUNTER_WIDTH 7} [get_bd_cells mem_manager_0]
create_bd_cell -type module -reference data_padder ch_a_x
create_bd_cell -type module -reference highest_bit highest_bit_0
create_bd_cell -type module -reference data_padder ch_a_y
create_bd_cell -type module -reference data_padder ch_a_amp
create_bd_cell -type module -reference data_padder ch_a_phase
create_bd_cell -type module -reference data_padder ch_b_X
create_bd_cell -type module -reference data_padder ch_b_Y
create_bd_cell -type module -reference data_padder ch_b_amp
create_bd_cell -type module -reference data_padder ch_b_phase
create_bd_cell -type module -reference data_writer data_writer_a_y
set_property -dict [list \
  CONFIG.USER_ID {"0001"} \
  CONFIG.C_M_TARGET_SLAVE_BASE_ADDR 0x18800000 \
  CONFIG.C_M_AXI_ID_WIDTH 3 \
] [get_bd_cells data_writer_a_y]
create_bd_cell -type module -reference data_writer data_writer_a_amp
set_property -dict [list \
  CONFIG.USER_ID {"0010"} \
  CONFIG.C_M_TARGET_SLAVE_BASE_ADDR 0x19000000 \
  CONFIG.C_M_AXI_ID_WIDTH 3 \
] [get_bd_cells data_writer_a_amp]
create_bd_cell -type module -reference data_writer data_writer_a_phase
set_property -dict [list \
  CONFIG.USER_ID {"0011"} \
  CONFIG.C_M_TARGET_SLAVE_BASE_ADDR 0x19800000 \
  CONFIG.C_M_AXI_ID_WIDTH 3 \
] [get_bd_cells data_writer_a_phase]
create_bd_cell -type module -reference data_writer data_writer_b_x
set_property -dict [list \
  CONFIG.USER_ID {"0100"} \
  CONFIG.C_M_TARGET_SLAVE_BASE_ADDR 0x1A000000 \
  CONFIG.C_M_AXI_ID_WIDTH 3 \
] [get_bd_cells data_writer_b_x]
create_bd_cell -type module -reference data_writer data_writer_b_y
set_property -dict [list \
  CONFIG.USER_ID {"0101"} \
  CONFIG.C_M_TARGET_SLAVE_BASE_ADDR 0x1A800000 \
  CONFIG.C_M_AXI_ID_WIDTH 3 \
] [get_bd_cells data_writer_b_y]
create_bd_cell -type module -reference data_writer data_writer_b_amp
set_property -dict [list \
  CONFIG.USER_ID {"0110"} \
  CONFIG.C_M_TARGET_SLAVE_BASE_ADDR 0x1B000000 \
  CONFIG.C_M_AXI_ID_WIDTH 3 \
] [get_bd_cells data_writer_b_amp]
create_bd_cell -type module -reference data_writer data_writer_b_phase
set_property -dict [list \
  CONFIG.USER_ID {"0111"} \
  CONFIG.C_M_TARGET_SLAVE_BASE_ADDR 0x1B800000 \
  CONFIG.C_M_AXI_ID_WIDTH 3 \
] [get_bd_cells data_writer_b_phase]
create_bd_cell -type module -reference two_clk_accum sample_clk

# ---- hierarchy /memory_interface/settings ----
current_bd_instance /memory_interface/settings
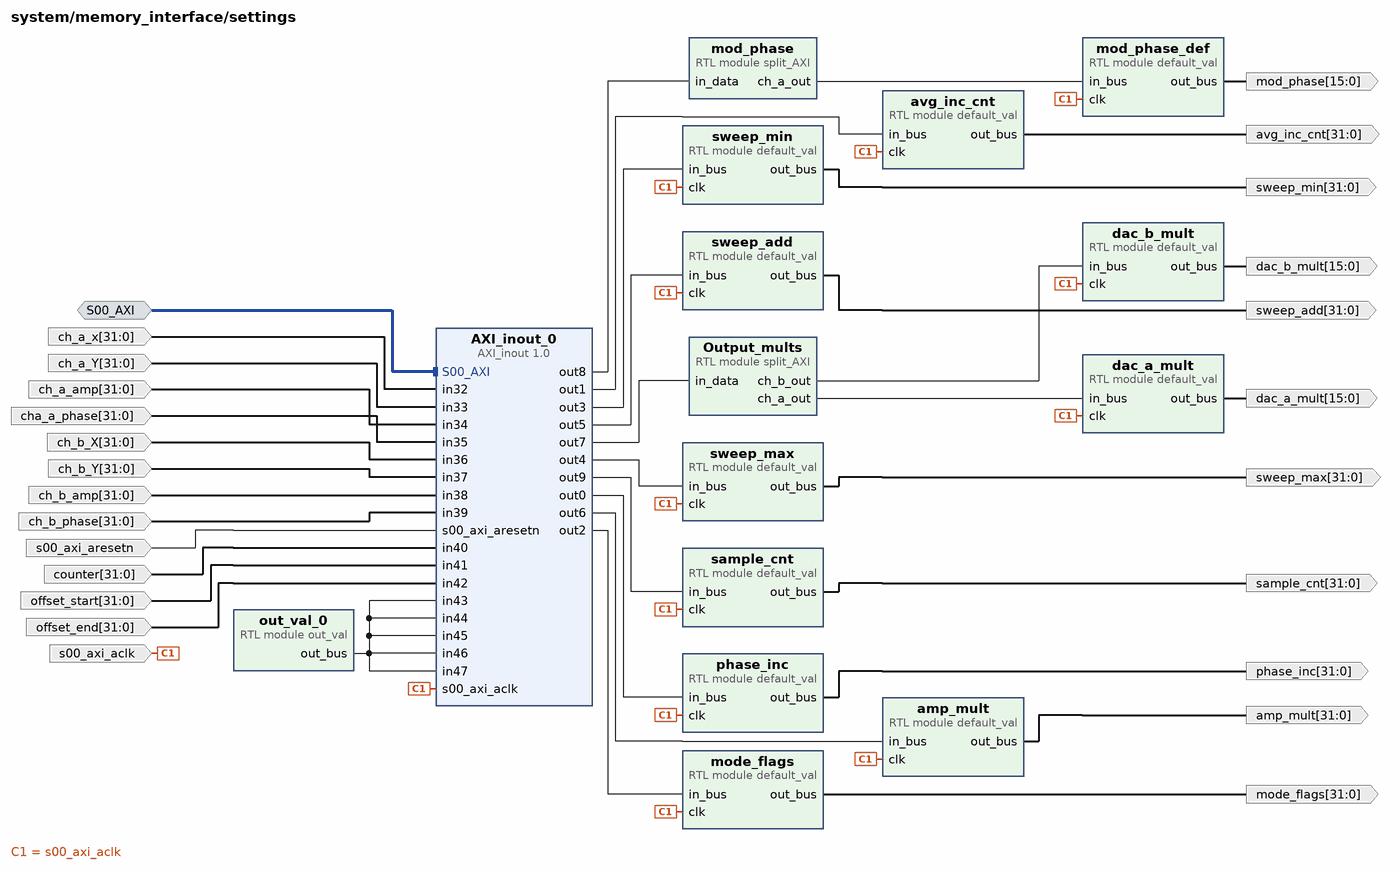
[diagram p9: block diagram inside /memory_interface/settings]
create_bd_intf_pin -mode Slave -vlnv xilinx.com:interface:aximm_rtl:1.0 S00_AXI
create_bd_pin -dir I -type clk s00_axi_aclk
create_bd_pin -dir O -from 31 -to 0 sweep_add
create_bd_pin -dir O -from 31 -to 0 phase_inc
create_bd_pin -dir O -from 15 -to 0 dac_b_mult
create_bd_pin -dir O -from 31 -to 0 avg_inc_cnt
create_bd_pin -dir O -from 31 -to 0 mode_flags
create_bd_pin -dir O -from 15 -to 0 dac_a_mult
create_bd_pin -dir O -from 31 -to 0 sweep_min
create_bd_pin -dir I -from 31 -to 0 ch_a_x
create_bd_pin -dir I -from 31 -to 0 ch_a_Y
create_bd_pin -dir I -from 31 -to 0 ch_a_amp
create_bd_pin -dir I -from 31 -to 0 cha_a_phase
create_bd_pin -dir I -from 31 -to 0 ch_b_X
create_bd_pin -dir I -from 31 -to 0 ch_b_Y
create_bd_pin -dir I -from 31 -to 0 ch_b_amp
create_bd_pin -dir I -from 31 -to 0 ch_b_phase
create_bd_pin -dir I -type rst s00_axi_aresetn
create_bd_pin -dir O -from 31 -to 0 amp_mult
create_bd_pin -dir O -from 31 -to 0 sweep_max
create_bd_pin -dir O -from 15 -to 0 mod_phase
create_bd_pin -dir O -from 31 -to 0 sample_cnt
create_bd_pin -dir I -from 31 -to 0 counter
create_bd_pin -dir I -from 31 -to 0 offset_start
create_bd_pin -dir I -from 31 -to 0 offset_end

create_bd_cell -type ip -vlnv xilinx.com:user:AXI_inout:1.0 AXI_inout_0
create_bd_cell -type module -reference default_val phase_inc
set_property -dict {CONFIG.num_bits 32 CONFIG.value 343597} [get_bd_cells phase_inc]
create_bd_cell -type module -reference default_val dac_b_mult
set_property -dict {CONFIG.num_bits 16} [get_bd_cells dac_b_mult]
create_bd_cell -type module -reference split_AXI Output_mults
set_property -dict {CONFIG.OUT_DATA_WIDTH 16} [get_bd_cells Output_mults]
create_bd_cell -type module -reference default_val avg_inc_cnt
set_property -dict {CONFIG.num_bits 32 CONFIG.value 10995116} [get_bd_cells avg_inc_cnt]
create_bd_cell -type module -reference default_val mode_flags
set_property -dict {CONFIG.num_bits 32 CONFIG.value 0} [get_bd_cells mode_flags]
create_bd_cell -type module -reference default_val sweep_min
set_property -dict {CONFIG.num_bits 32 CONFIG.value 1073741824} [get_bd_cells sweep_min]
create_bd_cell -type module -reference out_val out_val_0
set_property -dict {CONFIG.num_bits 32 CONFIG.value 0} [get_bd_cells out_val_0]
create_bd_cell -type module -reference default_val sweep_max
set_property -dict {CONFIG.num_bits 32 CONFIG.value 3221225472} [get_bd_cells sweep_max]
create_bd_cell -type module -reference default_val sweep_add
set_property -dict {CONFIG.num_bits 32 CONFIG.value 4398} [get_bd_cells sweep_add]
create_bd_cell -type module -reference default_val amp_mult
set_property -dict {CONFIG.num_bits 32 CONFIG.value 1073741824} [get_bd_cells amp_mult]
create_bd_cell -type module -reference default_val dac_a_mult
set_property -dict {CONFIG.num_bits 16} [get_bd_cells dac_a_mult]
create_bd_cell -type module -reference default_val mod_phase_def
set_property -dict {CONFIG.num_bits 16 CONFIG.value 0} [get_bd_cells mod_phase_def]
create_bd_cell -type module -reference default_val sample_cnt
set_property -dict {CONFIG.num_bits 32 CONFIG.value 343597} [get_bd_cells sample_cnt]
create_bd_cell -type module -reference split_AXI mod_phase
set_property -dict {CONFIG.OUT_DATA_WIDTH 16} [get_bd_cells mod_phase]

# ---- connections ----

current_bd_instance /DDS
connect_bd_net [get_bd_pins out_val_0/out_bus] [get_bd_pins dds_compiler_0/s_axis_phase_tvalid] [get_bd_pins dds_compiler_1/s_axis_phase_tvalid]
connect_bd_net [get_bd_pins dds_compiler_0/m_axis_data_tdata] [get_bd_pins split_AXI_0/in_data]
connect_bd_net [get_bd_pins count_clk] [get_bd_pins phase_gen/count_clk]
connect_bd_net [get_bd_pins out_clk] \
  [get_bd_pins dds_compiler_0/aclk] [get_bd_pins dds_compiler_1/aclk] [get_bd_pins c_addsub_0/CLK] \
  [get_bd_pins freq_doubler_0/clk] [get_bd_pins phase_gen/out_clk]
connect_bd_net [get_bd_pins inc_in] [get_bd_pins phase_gen/inc_in]
connect_bd_net [get_bd_pins sync_i] [get_bd_pins phase_gen/sync_i]
connect_bd_net [get_bd_pins split_AXI_0/ch_a_out] [get_bd_pins cos_out]
connect_bd_net [get_bd_pins split_AXI_0/ch_b_out] [get_bd_pins sin_out]
connect_bd_net [get_bd_pins dds_compiler_1/m_axis_data_tdata] [get_bd_pins split_AXI_1/in_data]
connect_bd_net [get_bd_pins split_AXI_1/ch_a_out] [get_bd_pins cos_shift_out]
connect_bd_net [get_bd_pins phase_gen/count_out] [get_bd_pins c_addsub_0/A] [get_bd_pins freq_doubler_0/phase_in]
connect_bd_net [get_bd_pins freq_doubler_0/phase_out] [get_bd_pins dds_compiler_0/s_axis_phase_tdata]
connect_bd_net [get_bd_pins freq_double] [get_bd_pins freq_doubler_0/freq_double]
connect_bd_net [get_bd_pins c_addsub_0/S] [get_bd_pins dds_compiler_1/s_axis_phase_tdata]
connect_bd_net [get_bd_pins phase_lead] [get_bd_pins c_addsub_0/B]

current_bd_instance /ch_a_processing
connect_bd_net [get_bd_pins mult_gen_0/P] [get_bd_pins c_addsub_0/A]
connect_bd_net [get_bd_pins mult_gen_1/P] [get_bd_pins c_addsub_0/B]
connect_bd_net [get_bd_pins comb_AXI_0/out_data] [get_bd_pins atan/s_axis_cartesian_tdata]
connect_bd_net [get_bd_pins out_val_0/out_bus] [get_bd_pins sqrt/s_axis_cartesian_tvalid] [get_bd_pins atan/s_axis_cartesian_tvalid]
connect_bd_net -net ps_0_FCLK_CLK0 [get_bd_pins CLK] \
  [get_bd_pins mult_gen_1/CLK] [get_bd_pins c_addsub_0/CLK] [get_bd_pins sqrt/aclk] [get_bd_pins atan/aclk] \
  [get_bd_pins mult_gen_0/CLK] [get_bd_pins Lock_in_Y/CLK] [get_bd_pins Lock_in_X/CLK]
connect_bd_net -net Lock_in_a_Y_out_data [get_bd_pins Lock_in_Y/out_data] \
  [get_bd_pins Y_out] [get_bd_pins mult_gen_0/B] [get_bd_pins mult_gen_0/A] [get_bd_pins comb_AXI_0/ch_b_in]
connect_bd_net -net Lock_in_a_X_out_data [get_bd_pins Lock_in_X/out_data] \
  [get_bd_pins X_out] [get_bd_pins mult_gen_1/B] [get_bd_pins mult_gen_1/A] [get_bd_pins comb_AXI_0/ch_a_in]
connect_bd_net -net cordic_0_m_axis_dout_tdata [get_bd_pins sqrt/m_axis_dout_tdata] [get_bd_pins amp_out]
connect_bd_net -net cordic_1_m_axis_dout_tdata [get_bd_pins atan/m_axis_dout_tdata] [get_bd_pins phase_out]
connect_bd_net -net adc_2comp_0_adc_a_o [get_bd_pins signal_in] [get_bd_pins Lock_in_Y/signal_in] [get_bd_pins Lock_in_X/signal_in]
connect_bd_net [get_bd_pins counter] [get_bd_pins Lock_in_Y/counter] [get_bd_pins Lock_in_X/counter]
connect_bd_net -net out_val_0_out_bus [get_bd_pins cnt_inc] [get_bd_pins Lock_in_Y/cnt_inc] [get_bd_pins Lock_in_X/cnt_inc]
connect_bd_net [get_bd_pins c_addsub_0/S] [get_bd_pins sqrt/s_axis_cartesian_tdata]
connect_bd_net [get_bd_pins ref_in_sin] [get_bd_pins Lock_in_Y/ref_in]
connect_bd_net [get_bd_pins ref_in_cos] [get_bd_pins Lock_in_X/ref_in]

current_bd_instance /ch_a_processing/Lock_in_Y
connect_bd_net [get_bd_pins mult_gen_1/P] [get_bd_pins moving_average_0/in_data]
connect_bd_net [get_bd_pins simple_summation_0/cnt_timer] [get_bd_pins moving_average_0/clk]
connect_bd_net [get_bd_pins mult_gen_0/P] [get_bd_pins simple_summation_0/in_data]
connect_bd_net -net ps_0_FCLK_CLK0 [get_bd_pins CLK] [get_bd_pins mult_gen_0/CLK] [get_bd_pins mult_gen_1/CLK] [get_bd_pins simple_summation_0/clk]
connect_bd_net -net adc_2comp_0_adc_a_o [get_bd_pins signal_in] [get_bd_pins mult_gen_0/A]
connect_bd_net [get_bd_pins simple_summation_0/sum_out] [get_bd_pins mult_gen_1/A]
connect_bd_net [get_bd_pins counter] [get_bd_pins simple_summation_0/counter]
connect_bd_net [get_bd_pins cnt_inc] [get_bd_pins mult_gen_1/B]
connect_bd_net [get_bd_pins moving_average_0/out_data] [get_bd_pins out_data]
connect_bd_net [get_bd_pins ref_in] [get_bd_pins mult_gen_0/B]

current_bd_instance /ch_a_processing/Lock_in_X
connect_bd_net [get_bd_pins mult_gen_1/P] [get_bd_pins moving_average_0/in_data]
connect_bd_net [get_bd_pins simple_summation_0/cnt_timer] [get_bd_pins moving_average_0/clk]
connect_bd_net [get_bd_pins mult_gen_0/P] [get_bd_pins simple_summation_0/in_data]
connect_bd_net -net ps_0_FCLK_CLK0 [get_bd_pins CLK] [get_bd_pins mult_gen_0/CLK] [get_bd_pins mult_gen_1/CLK] [get_bd_pins simple_summation_0/clk]
connect_bd_net -net adc_2comp_0_adc_a_o [get_bd_pins signal_in] [get_bd_pins mult_gen_0/A]
connect_bd_net [get_bd_pins simple_summation_0/sum_out] [get_bd_pins mult_gen_1/A]
connect_bd_net [get_bd_pins counter] [get_bd_pins simple_summation_0/counter]
connect_bd_net [get_bd_pins cnt_inc] [get_bd_pins mult_gen_1/B]
connect_bd_net [get_bd_pins moving_average_0/out_data] [get_bd_pins out_data]
connect_bd_net [get_bd_pins ref_in] [get_bd_pins mult_gen_0/B]

current_bd_instance /ch_b_processing
connect_bd_net [get_bd_pins mult_gen_0/P] [get_bd_pins c_addsub_0/A]
connect_bd_net [get_bd_pins mult_gen_1/P] [get_bd_pins c_addsub_0/B]
connect_bd_net [get_bd_pins comb_AXI_0/out_data] [get_bd_pins atan/s_axis_cartesian_tdata]
connect_bd_net [get_bd_pins out_val_0/out_bus] [get_bd_pins sqrt/s_axis_cartesian_tvalid] [get_bd_pins atan/s_axis_cartesian_tvalid]
connect_bd_net -net ps_0_FCLK_CLK0 [get_bd_pins CLK] \
  [get_bd_pins mult_gen_1/CLK] [get_bd_pins c_addsub_0/CLK] [get_bd_pins sqrt/aclk] [get_bd_pins atan/aclk] \
  [get_bd_pins mult_gen_0/CLK] [get_bd_pins Lock_in_Y/CLK] [get_bd_pins Lock_in_X/CLK]
connect_bd_net -net Lock_in_a_Y_out_data [get_bd_pins Lock_in_Y/out_data] \
  [get_bd_pins Y_out] [get_bd_pins mult_gen_0/B] [get_bd_pins mult_gen_0/A] [get_bd_pins comb_AXI_0/ch_b_in]
connect_bd_net -net Lock_in_a_X_out_data [get_bd_pins Lock_in_X/out_data] \
  [get_bd_pins X_out] [get_bd_pins mult_gen_1/B] [get_bd_pins mult_gen_1/A] [get_bd_pins comb_AXI_0/ch_a_in]
connect_bd_net -net cordic_0_m_axis_dout_tdata [get_bd_pins sqrt/m_axis_dout_tdata] [get_bd_pins amp_out]
connect_bd_net -net cordic_1_m_axis_dout_tdata [get_bd_pins atan/m_axis_dout_tdata] [get_bd_pins phase_out]
connect_bd_net -net adc_2comp_0_adc_a_o [get_bd_pins signal_in] [get_bd_pins Lock_in_Y/signal_in] [get_bd_pins Lock_in_X/signal_in]
connect_bd_net [get_bd_pins counter] [get_bd_pins Lock_in_Y/counter] [get_bd_pins Lock_in_X/counter]
connect_bd_net -net out_val_0_out_bus [get_bd_pins cnt_inc] [get_bd_pins Lock_in_Y/cnt_inc] [get_bd_pins Lock_in_X/cnt_inc]
connect_bd_net [get_bd_pins c_addsub_0/S] [get_bd_pins sqrt/s_axis_cartesian_tdata]
connect_bd_net [get_bd_pins ref_in_sin] [get_bd_pins Lock_in_Y/ref_in]
connect_bd_net [get_bd_pins ref_in_cos] [get_bd_pins Lock_in_X/ref_in]

current_bd_instance /ch_b_processing/Lock_in_Y
connect_bd_net [get_bd_pins mult_gen_1/P] [get_bd_pins moving_average_0/in_data]
connect_bd_net [get_bd_pins simple_summation_0/cnt_timer] [get_bd_pins moving_average_0/clk]
connect_bd_net [get_bd_pins mult_gen_0/P] [get_bd_pins simple_summation_0/in_data]
connect_bd_net -net ps_0_FCLK_CLK0 [get_bd_pins CLK] [get_bd_pins mult_gen_0/CLK] [get_bd_pins mult_gen_1/CLK] [get_bd_pins simple_summation_0/clk]
connect_bd_net -net adc_2comp_0_adc_a_o [get_bd_pins signal_in] [get_bd_pins mult_gen_0/A]
connect_bd_net [get_bd_pins simple_summation_0/sum_out] [get_bd_pins mult_gen_1/A]
connect_bd_net [get_bd_pins counter] [get_bd_pins simple_summation_0/counter]
connect_bd_net [get_bd_pins cnt_inc] [get_bd_pins mult_gen_1/B]
connect_bd_net [get_bd_pins moving_average_0/out_data] [get_bd_pins out_data]
connect_bd_net [get_bd_pins ref_in] [get_bd_pins mult_gen_0/B]

current_bd_instance /ch_b_processing/Lock_in_X
connect_bd_net [get_bd_pins mult_gen_1/P] [get_bd_pins moving_average_0/in_data]
connect_bd_net [get_bd_pins simple_summation_0/cnt_timer] [get_bd_pins moving_average_0/clk]
connect_bd_net [get_bd_pins mult_gen_0/P] [get_bd_pins simple_summation_0/in_data]
connect_bd_net -net ps_0_FCLK_CLK0 [get_bd_pins CLK] [get_bd_pins mult_gen_0/CLK] [get_bd_pins mult_gen_1/CLK] [get_bd_pins simple_summation_0/clk]
connect_bd_net -net adc_2comp_0_adc_a_o [get_bd_pins signal_in] [get_bd_pins mult_gen_0/A]
connect_bd_net [get_bd_pins simple_summation_0/sum_out] [get_bd_pins mult_gen_1/A]
connect_bd_net [get_bd_pins counter] [get_bd_pins simple_summation_0/counter]
connect_bd_net [get_bd_pins cnt_inc] [get_bd_pins mult_gen_1/B]
connect_bd_net [get_bd_pins moving_average_0/out_data] [get_bd_pins out_data]
connect_bd_net [get_bd_pins ref_in] [get_bd_pins mult_gen_0/B]

current_bd_instance /memory_interface
connect_bd_intf_net [get_bd_intf_pins settings/S00_AXI] [get_bd_intf_pins ps_0_axi_periph/M00_AXI]
connect_bd_intf_net -intf_net data_writer_0_M_AXI [get_bd_intf_pins data_writer_a_x/M_AXI] [get_bd_intf_pins axi_mem_intercon/S00_AXI]
connect_bd_intf_net -intf_net data_writer_1_M_AXI [get_bd_intf_pins data_writer_a_y/M_AXI] [get_bd_intf_pins axi_mem_intercon/S01_AXI]
connect_bd_intf_net -intf_net data_writer_2_M_AXI [get_bd_intf_pins data_writer_a_amp/M_AXI] [get_bd_intf_pins axi_mem_intercon/S02_AXI]
connect_bd_intf_net -intf_net data_writer_3_M_AXI [get_bd_intf_pins data_writer_a_phase/M_AXI] [get_bd_intf_pins axi_mem_intercon/S03_AXI]
connect_bd_intf_net -intf_net data_writer_4_M_AXI [get_bd_intf_pins data_writer_b_x/M_AXI] [get_bd_intf_pins axi_mem_intercon/S04_AXI]
connect_bd_intf_net -intf_net data_writer_5_M_AXI [get_bd_intf_pins data_writer_b_y/M_AXI] [get_bd_intf_pins axi_mem_intercon/S05_AXI]
connect_bd_intf_net -intf_net data_writer_6_M_AXI [get_bd_intf_pins data_writer_b_amp/M_AXI] [get_bd_intf_pins axi_mem_intercon/S06_AXI]
connect_bd_intf_net -intf_net data_writer_7_M_AXI [get_bd_intf_pins data_writer_b_phase/M_AXI] [get_bd_intf_pins axi_mem_intercon/S07_AXI]
connect_bd_intf_net [get_bd_intf_pins S00_AXI] [get_bd_intf_pins ps_0_axi_periph/S00_AXI]
connect_bd_intf_net [get_bd_intf_pins M00_AXI] [get_bd_intf_pins axi_mem_intercon/M00_AXI]
connect_bd_net -net ps_0_FCLK_CLK0 [get_bd_pins clk] \
  [get_bd_pins rst_clk_wiz_0_125M/slowest_sync_clk] [get_bd_pins data_writer_a_x/CLK] [get_bd_pins mem_manager_0/clk] \
  [get_bd_pins settings/s00_axi_aclk] [get_bd_pins ps_0_axi_periph/S00_ACLK] [get_bd_pins ps_0_axi_periph/M00_ACLK] \
  [get_bd_pins ps_0_axi_periph/ACLK] [get_bd_pins axi_mem_intercon/S00_ACLK] [get_bd_pins axi_mem_intercon/ACLK] \
  [get_bd_pins axi_mem_intercon/M00_ACLK] [get_bd_pins axi_mem_intercon/S01_ACLK] [get_bd_pins axi_mem_intercon/S02_ACLK] \
  [get_bd_pins axi_mem_intercon/S03_ACLK] [get_bd_pins axi_mem_intercon/S04_ACLK] [get_bd_pins axi_mem_intercon/S05_ACLK] \
  [get_bd_pins axi_mem_intercon/S06_ACLK] [get_bd_pins axi_mem_intercon/S07_ACLK] [get_bd_pins data_writer_a_y/CLK] \
  [get_bd_pins data_writer_a_amp/CLK] [get_bd_pins data_writer_a_phase/CLK] [get_bd_pins data_writer_b_x/CLK] \
  [get_bd_pins data_writer_b_y/CLK] [get_bd_pins data_writer_b_amp/CLK] [get_bd_pins data_writer_b_phase/CLK] \
  [get_bd_pins sample_clk/out_clk]
connect_bd_net -net out_val_0_out_bus [get_bd_pins settings/avg_inc_cnt] [get_bd_pins avg_inc_cnt]
connect_bd_net -net sweep_max_out_bus [get_bd_pins settings/sweep_max] [get_bd_pins sweep_max]
connect_bd_net -net sweep_min_out_bus [get_bd_pins settings/sweep_min] [get_bd_pins sweep_min]
connect_bd_net -net default_val_0_out_bus [get_bd_pins settings/phase_inc] [get_bd_pins phase_inc]
connect_bd_net -net default_val_0_out_bus3 [get_bd_pins settings/amp_mult] [get_bd_pins amp_mult]
connect_bd_net -net dac_a_mult_out_bus [get_bd_pins settings/dac_a_mult] [get_bd_pins dac_a_mult]
connect_bd_net -net default_val_0_out_bus2 [get_bd_pins settings/sweep_add] [get_bd_pins sweep_add]
connect_bd_net -net dac_b_mult_out_bus [get_bd_pins settings/dac_b_mult] [get_bd_pins dac_b_mult]
connect_bd_net -net default_val_0_out_bus1 [get_bd_pins settings/mode_flags] [get_bd_pins mode_flags]
connect_bd_net -net default_val_0_out_bus4 [get_bd_pins settings/mod_phase] [get_bd_pins mod_phase_lead]
connect_bd_net -net data_padder_0_data_out [get_bd_pins ch_a_x/data_out] [get_bd_pins data_writer_a_x/data_in] [get_bd_pins settings/ch_a_x]
connect_bd_net [get_bd_pins ch_a_X] [get_bd_pins ch_a_x/data_in]
connect_bd_net -net data_padder_0_data_out1 [get_bd_pins ch_a_y/data_out] [get_bd_pins settings/ch_a_Y] [get_bd_pins data_writer_a_y/data_in]
connect_bd_net [get_bd_pins ch_a_Y] [get_bd_pins ch_a_y/data_in]
connect_bd_net [get_bd_pins ch_a_amp] [get_bd_pins ch_a_amp/data_in]
connect_bd_net -net data_padder_1_data_out [get_bd_pins ch_a_amp/data_out] [get_bd_pins settings/ch_a_amp] [get_bd_pins data_writer_a_amp/data_in]
connect_bd_net -net data_padder_2_data_out [get_bd_pins ch_a_phase/data_out] \
  [get_bd_pins settings/cha_a_phase] [get_bd_pins data_writer_a_phase/data_in]
connect_bd_net [get_bd_pins ch_a_phase] [get_bd_pins ch_a_phase/data_in]
connect_bd_net -net data_padder_3_data_out [get_bd_pins ch_b_X/data_out] [get_bd_pins settings/ch_b_X] [get_bd_pins data_writer_b_x/data_in]
connect_bd_net [get_bd_pins ch_b_X] [get_bd_pins ch_b_X/data_in]
connect_bd_net -net data_padder_4_data_out [get_bd_pins ch_b_Y/data_out] [get_bd_pins settings/ch_b_Y] [get_bd_pins data_writer_b_y/data_in]
connect_bd_net [get_bd_pins ch_b_Y] [get_bd_pins ch_b_Y/data_in]
connect_bd_net -net data_padder_5_data_out [get_bd_pins ch_b_amp/data_out] [get_bd_pins settings/ch_b_amp] [get_bd_pins data_writer_b_amp/data_in]
connect_bd_net [get_bd_pins ch_b_amp] [get_bd_pins ch_b_amp/data_in]
connect_bd_net -net data_padder_6_data_out [get_bd_pins ch_b_phase/data_out] \
  [get_bd_pins settings/ch_b_phase] [get_bd_pins data_writer_b_phase/data_in]
connect_bd_net [get_bd_pins ch_b_phase] [get_bd_pins ch_b_phase/data_in]
connect_bd_net [get_bd_pins rst_clk_wiz_0_125M/interconnect_aresetn] [get_bd_pins ps_0_axi_periph/ARESETN] [get_bd_pins axi_mem_intercon/ARESETN]
connect_bd_net [get_bd_pins ext_reset_in] [get_bd_pins rst_clk_wiz_0_125M/ext_reset_in]
connect_bd_net [get_bd_pins dcm_locked] [get_bd_pins rst_clk_wiz_0_125M/dcm_locked]
connect_bd_net -net s00_axi_aresetn_1 [get_bd_pins rst_clk_wiz_0_125M/peripheral_aresetn] \
  [get_bd_pins data_writer_a_x/M_AXI_ARESETN] [get_bd_pins settings/s00_axi_aresetn] \
  [get_bd_pins axi_mem_intercon/S00_ARESETN] [get_bd_pins axi_mem_intercon/M00_ARESETN] \
  [get_bd_pins axi_mem_intercon/S01_ARESETN] [get_bd_pins axi_mem_intercon/S02_ARESETN] \
  [get_bd_pins axi_mem_intercon/S03_ARESETN] [get_bd_pins axi_mem_intercon/S04_ARESETN] \
  [get_bd_pins axi_mem_intercon/S05_ARESETN] [get_bd_pins axi_mem_intercon/S06_ARESETN] \
  [get_bd_pins axi_mem_intercon/S07_ARESETN] [get_bd_pins ps_0_axi_periph/S00_ARESETN] \
  [get_bd_pins ps_0_axi_periph/M00_ARESETN] [get_bd_pins data_writer_a_y/M_AXI_ARESETN] \
  [get_bd_pins data_writer_a_amp/M_AXI_ARESETN] [get_bd_pins data_writer_a_phase/M_AXI_ARESETN] \
  [get_bd_pins data_writer_b_x/M_AXI_ARESETN] [get_bd_pins data_writer_b_y/M_AXI_ARESETN] \
  [get_bd_pins data_writer_b_amp/M_AXI_ARESETN] [get_bd_pins data_writer_b_phase/M_AXI_ARESETN]
connect_bd_net [get_bd_pins mem_manager_0/offset] \
  [get_bd_pins data_writer_a_x/offset] [get_bd_pins data_writer_a_y/offset] [get_bd_pins data_writer_a_amp/offset] \
  [get_bd_pins data_writer_a_phase/offset] [get_bd_pins data_writer_b_x/offset] [get_bd_pins data_writer_b_y/offset] \
  [get_bd_pins data_writer_b_amp/offset] [get_bd_pins data_writer_b_phase/offset]
connect_bd_net [get_bd_pins highest_bit_0/bit_out] \
  [get_bd_pins data_writer_a_x/do_output] [get_bd_pins mem_manager_0/sample] [get_bd_pins data_writer_a_y/do_output] \
  [get_bd_pins data_writer_a_amp/do_output] [get_bd_pins data_writer_a_phase/do_output] \
  [get_bd_pins data_writer_b_x/do_output] [get_bd_pins data_writer_b_y/do_output] [get_bd_pins data_writer_b_amp/do_output] \
  [get_bd_pins data_writer_b_phase/do_output]
connect_bd_net [get_bd_pins loop_flag] [get_bd_pins mem_manager_0/loop_flag]
connect_bd_net [get_bd_pins settings/sample_cnt] [get_bd_pins sample_clk/inc_in]
connect_bd_net [get_bd_pins sample_clk/count_out] [get_bd_pins highest_bit_0/bus_in]
connect_bd_net [get_bd_pins count_clk] [get_bd_pins sample_clk/count_clk]
connect_bd_net [get_bd_pins sync_i] [get_bd_pins sample_clk/sync_i]
connect_bd_net -net mem_manager_0_counter_o [get_bd_pins mem_manager_0/counter_full] [get_bd_pins settings/counter]
connect_bd_net [get_bd_pins mem_manager_0/start_addr] [get_bd_pins settings/offset_start]
connect_bd_net [get_bd_pins mem_manager_0/end_addr] [get_bd_pins settings/offset_end]
connect_bd_net [get_bd_pins counter] [get_bd_pins mem_manager_0/counter]
connect_bd_net [get_bd_pins mem_manager_0/counter_min] [get_bd_pins counter_current]
